# Altium schematic sheet Ethernet.SchDoc
size 381 x 241 mm
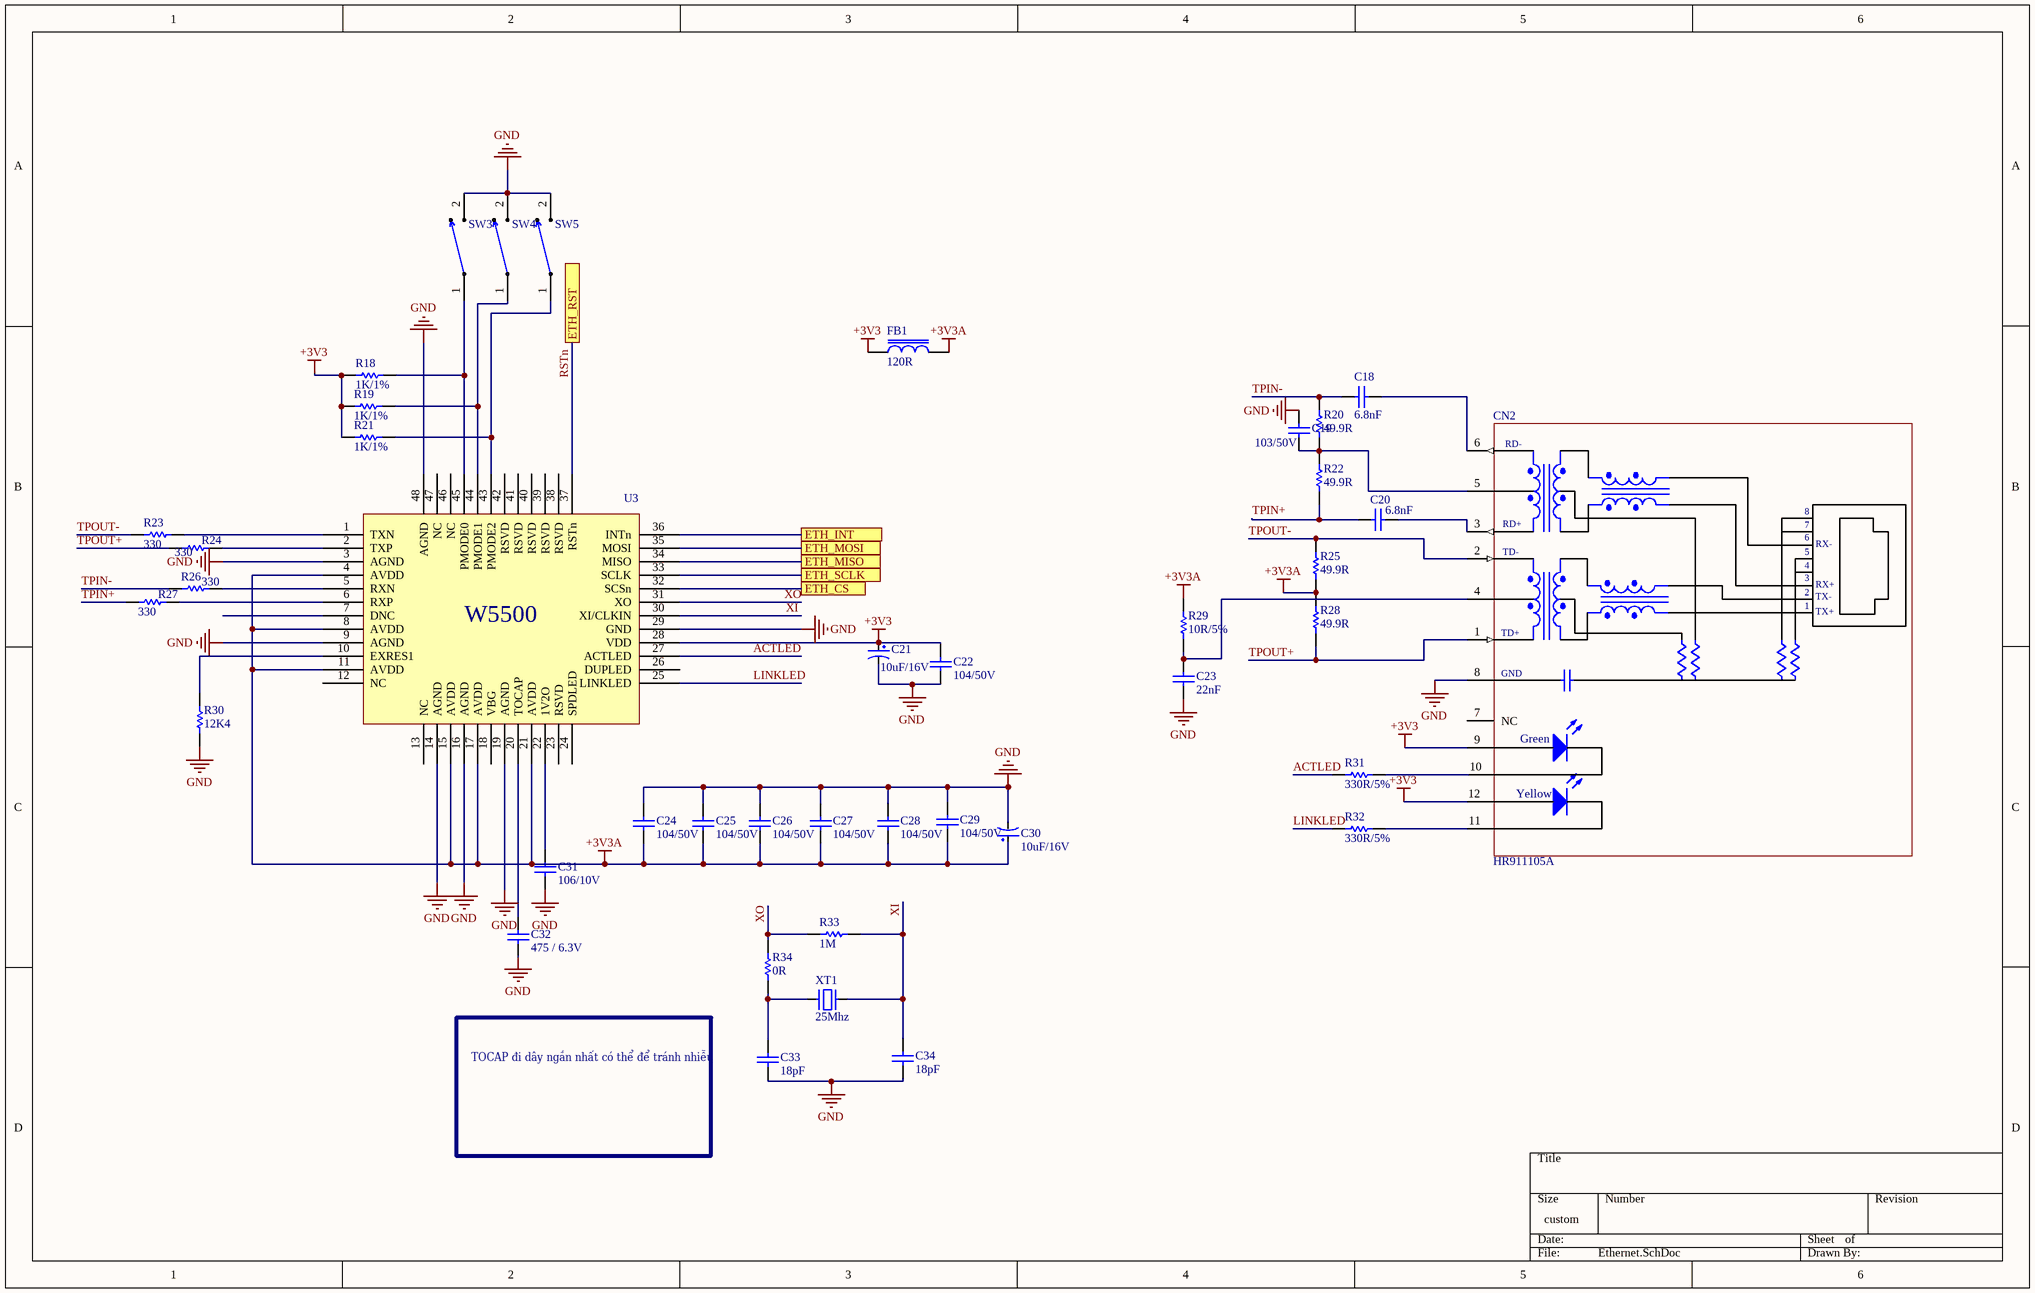
[diagram p0: Ethernet.SchDoc]

## Parts
C18  6.8nF  [C0603-B]
C19  103/50V  [C0603-B]
C20  6.8nF  [C0603-B]
C21  10uF/16V  [CAP_3216]
C22  104/50V  [C0603-B]
C23  22nF  [C0603-B]
C24  104/50V  [C0603-B]
C25  104/50V  [C0603-B]
C26  104/50V  [C0603-B]
C27  104/50V  [C0603-B]
C28  104/50V  [C0603-B]
C29  104/50V  [C0603-B]
C30  10uF/16V  [CAP_3216]
C31  106/10V  [C0603-B]
C32  475 / 6.3V  [C0603-B]
C33  18pF  [C0603-B]
C34  18pF  [C0603-B]
CN2  HR911105A  [HR911105A]
FB1  120R  [FB0805-B]
R18  1K/1%  [R0603-B]
R19  1K/1%  [R0603-B]
R20  49.9R  [R0603-B]
R21  1K/1%  [R0603-B]
R22  49.9R  [R0603-B]
R23  330  [R0603-B]
R24  330  [R0603-B]
R25  49.9R  [R0603-B]
R26  330  [R0603-B]
R27  330  [R0603-B]
R28  49.9R  [R0603-B]
R29  10R/5%  [R0603-B]
R30  12K4  [R0603-B]
R31  330R/5%  [R0603-B]
R32  330R/5%  [R0603-B]
R33  1M  [R0603-B]
R34  0R  [R0603-B]
SW3  Switch NO  [SW0.5 NO]  (value not drawn)
SW4  Switch NO  [SW0.5 NO]  (value not drawn)
SW5  Switch NO  [SW0.5 NO]  (value not drawn)
U3  W5500  [LQFP 48]  (value not drawn)
XT1  25Mhz  [XTAL-RU49/4]

## Ports
ETH_CS, ETH_INT, ETH_MISO, ETH_MOSI, ETH_RST, ETH_SCLK

## Nets
+3V3: C21.1 C22.2 CN2.9 CN2.12 FB1.1 R18.1 R19.1 R21.1 U3.28(VDD)
+3V3A: C24.1 C25.1 C26.1 C27.1 C28.1 C29.1 C30.1 FB1.2 R25.2 R28.1 R29.2 U3.4(AVDD) U3.8(AVDD) U3.11(AVDD) U3.15(AVDD) U3.17(AVDD) U3.21(AVDD)
GND: C19.2 C21.2 C22.1 C23.1 C24.2 C25.2 C26.2 C27.2 C28.2 C29.2 C30.2 C31.1 C32.1 C33.1 C34.1 CN2.8(GND) R30.1 SW3.2 SW4.2 SW5.2 U3.3(AGND) U3.9(AGND) U3.14(AGND) U3.16(AGND) U3.19(AGND) U3.29(GND) U3.48(AGND)
ACTLED: R31.1 U3.27(ACTLED)
ETH_CS: U3.32(SCSn) ; port ETH_CS
ETH_INT: U3.36(INTn) ; port ETH_INT
ETH_MISO: U3.34(MISO) ; port ETH_MISO
ETH_MOSI: U3.35(MOSI) ; port ETH_MOSI
ETH_SCLK: U3.33(SCLK) ; port ETH_SCLK
LINKLED: R32.1 U3.25(LINKLED)
RSTn: U3.37(RSTn) ; port ETH_RST
TPIN+: C20.1 R22.2 R27.1
TPIN-: C18.1 R20.1 R26.1
TPOUT+: CN2.1(TD+) R24.1 R28.2
TPOUT-: CN2.2(TD-) R23.1 R25.1
XI: C34.2 R33.1 U3.30(XI/CLKIN) XT1.2
XO: R33.2 R34.2 U3.31(XO)
NetC18_2: C18.2 CN2.6(RD-)
NetC19_1: C19.1 CN2.5 R20.2 R22.1
NetC20_2: C20.2 CN2.3(RD+)
NetC23_2: C23.2 CN2.4 R29.1
NetC31_2: C31.2 U3.22(1V2O)
NetC32_2: C32.2 U3.20(TOCAP)
NetC33_2: C33.2 R34.1 XT1.1
NetCN2_10: CN2.10 R31.2
NetCN2_11: CN2.11 R32.2
NetR18_2: R18.2 SW3.1 U3.45(PMODE0)
NetR19_2: R19.2 SW4.1 U3.44(PMODE1)
NetR21_2: R21.2 SW5.1 U3.43(PMODE2)
NetR23_2: R23.2 U3.1(TXN)
NetR24_2: R24.2 U3.2(TXP)
NetR26_2: R26.2 U3.5(RXN)
NetR27_2: R27.2 U3.6(RXP)
NetR30_2: R30.2 U3.10(EXRES1)

Not connected (* = marked no-connect by the designer): CN2 7(NC); U3 7(DNC) 12(NC) 13(NC) 18(VBG) 23(RSVD) 24(SPDLED) 26(DUPLED) 38(RSVD) 39(RSVD) 40(RSVD) 41(RSVD) 42(RSVD) 46(NC) 47(NC)

## Notes on the sheet
- (near C33) TOCAP đi dây ngắn nhất có thể để tránh nhiễu
- (in symbol HR911105A) RX-; RX+; TX-; TX+; Green; Yellow

## Library data of the parts
C18 C20 = CL10B683KB8NNNC: 50V 68nF X7R ±10% 0603 Multilayer Ceramic Capacitors MLCC - SMD/SMT ROHS; BSH Partnumber: C31658; Manufacture: Samsung Electro-Mechanics; Value: 683/50V; Pricing (USD): 0.008; Partnumber: CL10B683KB8NNNC; Distributor: LCSC Electronics; Creator: Digo; Date: 20220127; ComponentLink1Description: Datasheet; ComponentLink1URL: https://item.szlcsc.com/32617.html; Datasheet: https://item.szlcsc.com/32617.html; ComponentLink2Description: Link sale; ComponentLink2URL: https://datasheet.lcsc.com/lcsc/1811072020_Samsung-Electro-Mechanics-CL10B683KB8NNNC_C31658.pdf; Link sale: https://datasheet.lcsc.com/lcsc/1811072020_Samsung-Electro-Mechanics-CL10B683KB8NNNC_C31658.pdf
C19 = CL10B103KB8NNNC: 10nF ±10% 50V X7R 0603 Multilayer Ceramic Capacitors MLCC - SMD/SMT RoHS; BSH Partnumber: C1589; Manufacture: Samsung Electro-Mechanics; Pricing (USD): 0.008; Partnumber: CL10B103KB8NNNC; Distributor: LCSC Electronics; Value: 103/50V; Creator: Digo; Date: 20210222; ComponentLink1Description: Datasheet; ComponentLink1URL: https://datasheet.lcsc.com/szlcsc/1810191222_Samsung-Electro-Mechanics-CL10B103KB8NNNC_C1589.pdf; Datasheet: https://datasheet.lcsc.com/szlcsc/1810191222_Samsung-Electro-Mechanics-CL10B103KB8NNNC_C1589.pdf; ComponentLink2Description: Link sale; ComponentLink2URL: https://lcsc.com/product-detail/Multilayer-Ceramic-Capacitors-MLCC-SMD-SMT_Samsung-Electro-Mechanics-CL10B103KB8NNNC_C1589.htmlhttps://lcsc.com/product-detail/Multilayer-Ceramic-Capacitors-MLCC-SMD-SMT_Samsung-Electro-Mechanics-CL10B103KB8NNNC_C1589.html; Link sale: https://lcsc.com/product-detail/Multilayer-Ceramic-Capacitors-MLCC-SMD-SMT_Samsung-Electro-Mechanics-CL10B103KB8NNNC_C1589.htmlhttps://lcsc.com/product-detail/Multilayer-Ceramic-Capacitors-MLCC-SMD-SMT_Samsung-Electro-Mechanics-CL10B103KB8NNNC_C1589.html
C21 C30 = CAP-ALU-SMD: Polarized Capacitor (Axial); Published: 8-Jun-2000; LatestRevisionDate: 17-Jul-2002; LatestRevisionNote: Re-released for DXP Platform.; PackageReference: POLAR0.8; Publisher: Altium Limited
C22 C24-C29 = CL10B104KB8NNNC: 100nF ±10% 50V X7R 0603 Multilayer Ceramic Capacitors MLCC - SMD/SMT RoHS; BSH Partnumber: C1591; Manufacture: Samsung Electro-Mechanics; Pricing (USD): 0.008; Partnumber: CL10B104KB8NNNC; Distributor: LCSC Electronics; Value: 104/50V; Creator: Digo; Date: 20210218; ComponentLink1Description: Datasheet; ComponentLink1URL: https://datasheet.lcsc.com/szlcsc/1811021431_Samsung-Electro-Mechanics-CL10B104KB8NNNC_C1591.pdf; Datasheet: https://datasheet.lcsc.com/szlcsc/1811021431_Samsung-Electro-Mechanics-CL10B104KB8NNNC_C1591.pdf; ComponentLink2Description: Link sale; ComponentLink2URL: https://item.szlcsc.com/1943.html; Link sale: https://item.szlcsc.com/1943.html
C23 = CL10B222KB8NNNC: 2.2nF ±10% 50V X7R 0603 Multilayer Ceramic Capacitors MLCC - SMD/SMT RoHS; BSH Partnumber: C16033; Manufacture: Samsung Electro-Mechanics; Value: 222/50V; Pricing (USD): 0.008; Partnumber: CL10B222KB8NNNC; Distributor: LCSC Electronics; Creator: Digo; Date: 20210222; ComponentLink1Description: Datasheet; ComponentLink1URL: https://datasheet.lcsc.com/szlcsc/1810261512_Samsung-Electro-Mechanics-CL10B222KB8NNNC_C16033.pdf; Datasheet: https://datasheet.lcsc.com/szlcsc/1810261512_Samsung-Electro-Mechanics-CL10B222KB8NNNC_C16033.pdf; ComponentLink2Description: Link sale; ComponentLink2URL: https://lcsc.com/product-detail/Multilayer-Ceramic-Capacitors-MLCC-SMD-SMT_SAMSUNG_CL10B222KB8NNNC_2-2nF-222-10-50V_C16033.html; Link sale: https://lcsc.com/product-detail/Multilayer-Ceramic-Capacitors-MLCC-SMD-SMT_SAMSUNG_CL10B222KB8NNNC_2-2nF-222-10-50V_C16033.html
C31 = CL10A106KP8NNNC: 10uF ±10% 10V X5R 0603 Multilayer Ceramic Capacitors MLCC - SMD/SMT RoHS; BSH Partnumber: C19702; Manufacture: Samsung Electro-Mechanics; Pricing (USD): 0.008; Partnumber: CL10A106KP8NNNC; Distributor: LCSC Electronics; Value: 106/10V; Creator: Digo; Date: 20210219; ComponentLink1Description: Datasheet; ComponentLink1URL: https://datasheet.lcsc.com/szlcsc/1810191219_Samsung-Electro-Mechanics-CL10A106KP8NNNC_C19702.pdf; Datasheet: https://datasheet.lcsc.com/szlcsc/1810191219_Samsung-Electro-Mechanics-CL10A106KP8NNNC_C19702.pdf; ComponentLink2Description: Link sale; ComponentLink2URL: https://item.szlcsc.com/20411.html; Link sale: https://item.szlcsc.com/20411.html
C32 = CL10A475MQ8NNNC: Multilayer Ceramic Capacitors MLCC - SMD/SMT 4.7uF+/-20% 6.3V X5R 1608; BSH Partnumber: New part; Manufacture: Samsung Electro-Mechanics; Pricing (USD): 0.008; Partnumber: CL10A475MQ8NNNC; Value: 475 / 6.3V; Creator: NamNH; Date: 20201215; ComponentLink1Description: Datasheet; ComponentLink1URL: https://www.mouser.vn/datasheet/2/585/MLCC-1837944.pdf; Datasheet: https://www.mouser.vn/datasheet/2/585/MLCC-1837944.pdf; ComponentLink2Description: Link sale; ComponentLink2URL: https://www.mouser.vn/ProductDetail/Samsung-Electro-Mechanics/CL10A475MQ8NNNC/?qs=X6jEic%2FHinBqyUv6Rpt3UA%3D%3D; Link sale: https://www.mouser.vn/ProductDetail/Samsung-Electro-Mechanics/CL10A475MQ8NNNC/?qs=X6jEic%2FHinBqyUv6Rpt3UA%3D%3D
C33 C34 = CL10A106KP8NNNC: 10uF ±10% 10V X5R 0603 Multilayer Ceramic Capacitors MLCC - SMD/SMT RoHS; BSH Partnumber: C19702; Manufacture: Samsung Electro-Mechanics; Value: 106/10V; Pricing (USD): 0.008; Partnumber: CL10A106KP8NNNC; Distributor: LCSC Electronics; Creator: Digo; Date: 20210219; ComponentLink1Description: Datasheet; ComponentLink1URL: https://datasheet.lcsc.com/szlcsc/1810191219_Samsung-Electro-Mechanics-CL10A106KP8NNNC_C19702.pdf; Datasheet: https://datasheet.lcsc.com/szlcsc/1810191219_Samsung-Electro-Mechanics-CL10A106KP8NNNC_C19702.pdf; ComponentLink2Description: Link sale; ComponentLink2URL: https://item.szlcsc.com/20411.html; Link sale: https://item.szlcsc.com/20411.html
CN2 = HR911105A: CON  RJ45  with Magnetics & LED; BSH Partnumber: CN-HR911105A; Manufacture: HanRun; Pricing (USD): 1.19; Partnumber: HR911105A; Value: HR911105A; Creator: ChienNQ; Date: 20150818; ComponentLink1Description: Datasheet; ComponentLink1URL: http://www.tme.vn/upload/pdf/HR911105A.pdf; Datasheet: http://www.tme.vn/upload/pdf/HR911105A.pdf; ComponentLink2Description: Link sale; ComponentLink2URL: http://www.mouser.com/ProductDetail/ALPS/SCHA5B0200/?qs=YMSFtX0bdJBJ9BVESQTYvg%3D%3D; Link sale: http://www.mouser.com/ProductDetail/ALPS/SCHA5B0200/?qs=YMSFtX0bdJBJ9BVESQTYvg%3D%3D
FB1 = CBW201209U301T: 2A 1 200mΩ 300Ω 100MHz 0805 Ferrite Beads ROHS; BSH Partnumber: C67451; Manufacture: FH; Value: 300 Ohms; Pricing (USD): 0.032; Partnumber: CBW201209U301T; Distributor: LCSC Electronics; Creator: Digo; Date: 20211109; ComponentLink1Description: Datasheet; ComponentLink1URL: https://datasheet.lcsc.com/lcsc/1811061723_FH-Guangdong-Fenghua-Advanced-Tech-CBW201209U301T_C67451.pdf; Datasheet: https://datasheet.lcsc.com/lcsc/1811061723_FH-Guangdong-Fenghua-Advanced-Tech-CBW201209U301T_C67451.pdf; ComponentLink2Description: Link sale; ComponentLink2URL: https://item.szlcsc.com/68546.html; Link sale: https://item.szlcsc.com/68546.html
R18 R19 R21 = RC0603FR-071KL: RES 0603 1K 1% 100mW; BSH Partnumber: R-1k-0603-1; Manufacture: Yageo; Pricing (USD): 0.002; Partnumber: RC0603FR-071KL; Distributor: Mouser; Value: 1K/1%; Creator: SmartDevice; Date: 20150818; ComponentLink1Description: Datasheet; ComponentLink1URL: http://www.mouser.com/ds/2/447/RC0603-272842.pdf; Datasheet: http://www.mouser.com/ds/2/447/RC0603-272842.pdf; ComponentLink2Description: Link sale; ComponentLink2URL: http://vn.mouser.com/ProductDetail/Yageo/RC0603FR-071KL/?qs=%2fha2pyFaduhXXNW8qwNUNqQ9kEEY7HXXvpzZHS3Y0h%2feQEDxZMSpaQ%3d%3d; Link sale: http://vn.mouser.com/ProductDetail/Yageo/RC0603FR-071KL/?qs=%2fha2pyFaduhXXNW8qwNUNqQ9kEEY7HXXvpzZHS3Y0h%2feQEDxZMSpaQ%3d%3d
R20 R22 R25 R28 = RC0603FR-0710KL: RES 0603 10K 1% 100mW; BSH Partnumber: C98220; Manufacture: Yageo; Value: 10K/1%; Pricing (USD): 0.002; Partnumber: RC0603FR-0710KL; Distributor: LCSC Electronics; Creator: Digo; Date: 20181029; ComponentLink1Description: Datasheet; ComponentLink1URL: https://datasheet.lcsc.com/lcsc/1811101934_YAGEO-RC0603FR-0710KL_C98220.pdf; Datasheet: https://datasheet.lcsc.com/lcsc/1811101934_YAGEO-RC0603FR-0710KL_C98220.pdf; ComponentLink2Description: Link sale; ComponentLink2URL: https://item.szlcsc.com/99429.html; Link sale: https://item.szlcsc.com/99429.html
R23 R24 R26 R27 = RC0603JR-0733RL: RES 0603 33R 5% 100mW; BSH Partnumber: R-33R-0603-5; Manufacture: Yageo; Pricing (USD): 0.002; Partnumber: RC0603JR-0733RL; Value: 330; Creator: ChienNQ; Date: 20150818; ComponentLink1Description: Datasheet; ComponentLink1URL: http://www.mouser.com/ds/2/447/RC0603-272842.pdf; Datasheet: http://www.mouser.com/ds/2/447/RC0603-272842.pdf; ComponentLink2Description: Link sale; ComponentLink2URL: http://vn.mouser.com/ProductDetail/Yageo/RC0603JR-0733RL/?qs=%2fha2pyFaduiI%252b%2f%2fp%2fYhTTdPtw1Ix8qdvSFVlr4feI0MvuVkMxYqj1w%3d%3d; Link sale: http://vn.mouser.com/ProductDetail/Yageo/RC0603JR-0733RL/?qs=%2fha2pyFaduiI%252b%2f%2fp%2fYhTTdPtw1Ix8qdvSFVlr4feI0MvuVkMxYqj1w%3d%3d
R29 = RC0603JR-0710RL: RES 0603 10R 5% 100mW; BSH Partnumber: C109317; Manufacture: Yageo; Pricing (USD): 0.002; Partnumber: RC0603JR-0710RL; Distributor: LCSC Electronics; Value: 10R/5%; Creator: Digo; Date: 20150818; ComponentLink1Description: Datasheet; ComponentLink1URL: https://datasheet.lcsc.com/lcsc/1810010232_YAGEO-RC0603JR-0710RL_C109317.pdf; Datasheet: https://datasheet.lcsc.com/lcsc/1810010232_YAGEO-RC0603JR-0710RL_C109317.pdf; ComponentLink2Description: Link sale; ComponentLink2URL: https://item.szlcsc.com/110538.html; Link sale: https://item.szlcsc.com/110538.html
R30 = RC0603FR-0712K4L: RES 0603 12.4K 1% 100mW; BSH Partnumber: R-12K4-0603-1; Manufacture: Yageo; Pricing (USD): 0.002; Partnumber: RC0603FR-0712K4L; Value: 12K4; Creator: ChienNQ; Date: 20150818; ComponentLink1Description: Datasheet; ComponentLink1URL: http://www.mouser.com/ds/2/447/RC0603-272842.pdf; Datasheet: http://www.mouser.com/ds/2/447/RC0603-272842.pdf; ComponentLink2Description: Link sale; ComponentLink2URL: http://vn.mouser.com/ProductDetail/Yageo/RC0603FR-0712K4L/?qs=%2fha2pyFaduhXXNW8qwNUNtQbIe9NkWgBBZ6AkwbdyUcbVAv%2f5NVMmA%3d%3d; Link sale: http://vn.mouser.com/ProductDetail/Yageo/RC0603FR-0712K4L/?qs=%2fha2pyFaduhXXNW8qwNUNtQbIe9NkWgBBZ6AkwbdyUcbVAv%2f5NVMmA%3d%3d
R31 R32 = RC0603JR-07330RL: RES 0603 330R 5% 100mW; BSH Partnumber: R-330R-0603-5; Manufacture: Yageo; Pricing (USD): 0.002; Partnumber: RC0603JR-07330RL; Distributor: Mouser; Value: 330R/5%; Creator: SmartDevice; Date: 20150818; ComponentLink1Description: Datasheet; ComponentLink1URL: http://www.mouser.com/ds/2/447/RC0603-272842.pdf; Datasheet: http://www.mouser.com/ds/2/447/RC0603-272842.pdf; ComponentLink2Description: Link sale; ComponentLink2URL: http://vn.mouser.com/ProductDetail/Yageo/RC0603JR-07330RL/?qs=sGAEpiMZZMu61qfTUdNhG0fejjHH2KXS1w8pBW1iJYA%3d; Link sale: http://vn.mouser.com/ProductDetail/Yageo/RC0603JR-07330RL/?qs=sGAEpiMZZMu61qfTUdNhG0fejjHH2KXS1w8pBW1iJYA%3d
R33 = RC0603JR-072ML: RES 0603 2M 5% 100mW; BSH Partnumber: R-2M-0603-5; Manufacture: Yageo; Value: 2M/5%; Pricing (USD): 0.002; Partnumber: RC0603JR-072ML; Distributor: Mouser; Creator: NamNHc; Date: 20170605; ComponentLink1Description: Datasheet; ComponentLink1URL: http://www.yageo.com.tw/exep/pages/download/literatures/PYu-R_INT-thick_7.pdf; Datasheet: http://www.yageo.com.tw/exep/pages/download/literatures/PYu-R_INT-thick_7.pdf; ComponentLink2Description: Link sale; ComponentLink2URL: https://www.digikey.com/product-detail/en/yageo/RC0603JR-072ML/311-2.0MGRCT-ND/729674; Link sale: https://www.digikey.com/product-detail/en/yageo/RC0603JR-072ML/311-2.0MGRCT-ND/729674
R34 = RC0603JR-070RL: RES 0603 0R 5% 100mW; BSH Partnumber: C95177; Manufacture: Yageo; Pricing (USD): 0.002; Partnumber: RC0603JR-070RL; Distributor: LCSC Electronics; Value: 0R; Creator: Digo; Date: 20160716; ComponentLink1Description: Datasheet; ComponentLink1URL: https://datasheet.lcsc.com/lcsc/1809281528_YAGEO-RC0603JR-070RL_C95177.pdf; Datasheet: https://datasheet.lcsc.com/lcsc/1809281528_YAGEO-RC0603JR-070RL_C95177.pdf; ComponentLink2Description: Link sale; ComponentLink2URL: https://item.szlcsc.com/96378.html; Link sale: https://item.szlcsc.com/96378.html
SW3-SW5 = PCB Switch NO: BSH Partnumber: New part; Manufacture: Wething; Pricing (USD): 0.32; Partnumber: PCB Switch NO; Distributor: Mouser; Creator: NamNH; Date: 20201009; ComponentLink1Description: Datasheet; ComponentLink2Description: Link sale
U3 = W5500: Hardwired TCP/IP embedded Ethernet controller that provides / easier Internet connection to embedded systems
XT1 = XT2_1: CRYSTAL 12.0000MHZ 18PF SMD; Manufacturer: IQD Frequency Products; Part number: LFXTAL036356REEL; Value: 12Mhz; Category: Crystals; Package: HC-49/US; User_Description: CRYSTAL 12.0000MHZ 18PF SMD